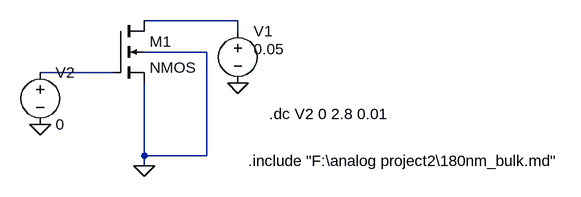
[diagram p0: schematic nmosCharacteristics.asc]
nmosCharacteristics.asc, the LTspice schematic file:
Version 4
SHEET 1 920 680
WIRE 320 112 176 112
WIRE 320 128 320 112
WIRE 272 160 176 160
WIRE 128 192 16 192
WIRE 176 320 176 208
WIRE 272 320 272 160
WIRE 272 320 176 320
WIRE 176 336 176 320
FLAG 320 208 0
FLAG 16 272 0
FLAG 176 336 0
SYMBOL nmos4 128 112 R0
SYMATTR InstName M1
SYMATTR Value2 l=180n w=540n
SYMBOL voltage 320 112 R0
WINDOW 3 24 44 Left 2
WINDOW 123 0 0 Left 2
WINDOW 39 0 0 Left 2
SYMATTR Value 0.05
SYMATTR InstName V1
SYMBOL voltage 16 176 R0
WINDOW 123 0 0 Left 2
WINDOW 39 0 0 Left 2
SYMATTR InstName V2
SYMATTR Value 0
TEXT 368 256 Left 2 !.dc V2 0 2.8 0.01
TEXT 336 328 Left 2 !.include "F:\\analog project2\\180nm_bulk.md"

The netlist it stands for:
* nmosCharacteristics.asc
M1 N001 N002 0 0 NMOS l=180n w=540n
V1 N001 0 0.05
V2 N002 0 0
.model NMOS NMOS
.model PMOS PMOS
.lib standard.mos
.dc V2 0 2.8 0.01
.include "F:\analog project2\180nm_bulk.md"
.backanno
.end